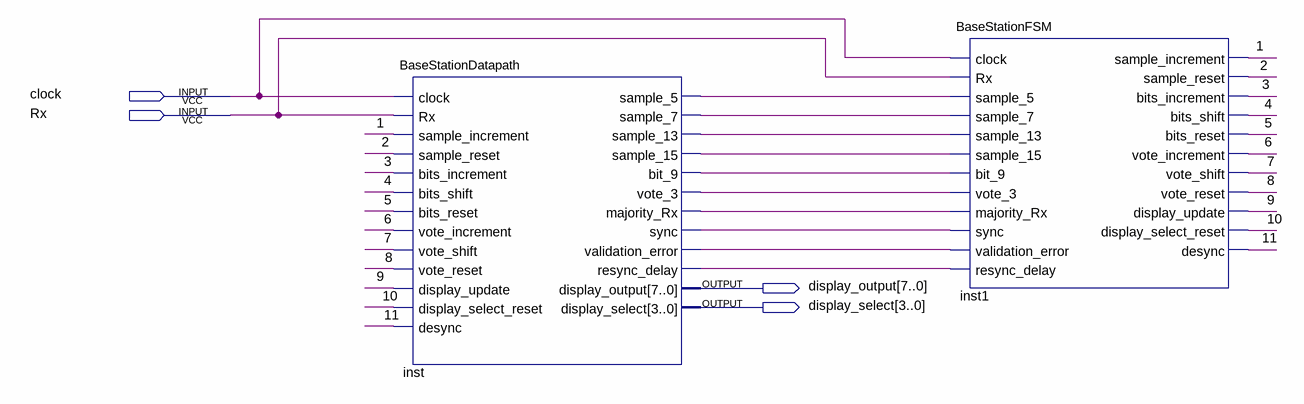
[diagram p0: schematic sheet]
// Quartus schematic BaseStationBlock.bdf as structural Verilog: 2 symbols, 4 pins
module BaseStationBlock (
  input  clock,
  input  Rx,
  output [7:0] display_output,
  output [3:0] display_select
);

  wire \1 , \2 , \3 , \4 , \5 , \6 , \7 , \8 , \9 , \10 , \11 , inst_bit_9, inst_majority_rx,
       inst_resync_delay, inst_sample_5, inst_sample_7, inst_sample_13, inst_sample_15, inst_sync,
       inst_validation_error, inst_vote_3;

  BaseStationDatapath inst (
    .clock(clock), .Rx(Rx), .sample_increment(\1 ), .sample_reset(\2 ), .bits_increment(\3 ),
    .bits_shift(\4 ), .bits_reset(\5 ), .vote_increment(\6 ), .vote_shift(\7 ), .vote_reset(\8 ),
    .display_update(\9 ), .display_select_reset(\10 ), .desync(\11 ), .sample_5(inst_sample_5),
    .sample_7(inst_sample_7), .sample_13(inst_sample_13), .sample_15(inst_sample_15), .bit_9(inst_bit_9),
    .vote_3(inst_vote_3), .majority_Rx(inst_majority_rx), .sync(inst_sync),
    .validation_error(inst_validation_error), .resync_delay(inst_resync_delay),
    .display_output(display_output), .display_select(display_select));
  BaseStationFSM inst1 (
    .clock(clock), .Rx(Rx), .sample_5(inst_sample_5), .sample_7(inst_sample_7), .sample_13(inst_sample_13),
    .sample_15(inst_sample_15), .bit_9(inst_bit_9), .vote_3(inst_vote_3), .majority_Rx(inst_majority_rx),
    .sync(inst_sync), .validation_error(inst_validation_error), .resync_delay(inst_resync_delay),
    .sample_increment(\1 ), .sample_reset(\2 ), .bits_increment(\3 ), .bits_shift(\4 ), .bits_reset(\5 ),
    .vote_increment(\6 ), .vote_shift(\7 ), .vote_reset(\8 ), .display_update(\9 ),
    .display_select_reset(\10 ), .desync(\11 ));
endmodule
